# Altium schematic sheet РЕУН.468323.001_Power.SchDoc: =Name-1str
size 420 x 297 mm; SheetNumber: 2; Вид изделия: Документация; Раздел: Документация; Код документа: РЕУН.468323.001Э3; Вид документа: Схема электрическая принципиальная; Класс документа: Конструкторский документ; Создавать изделие в PLM: Yes; DocumentCode: РЕУН.468323.001 Э3 2D; DocumentView: Схема электрическая принципиальная; DocumentClass: Конструкторский документ; ProductView: Документация; Format: А3
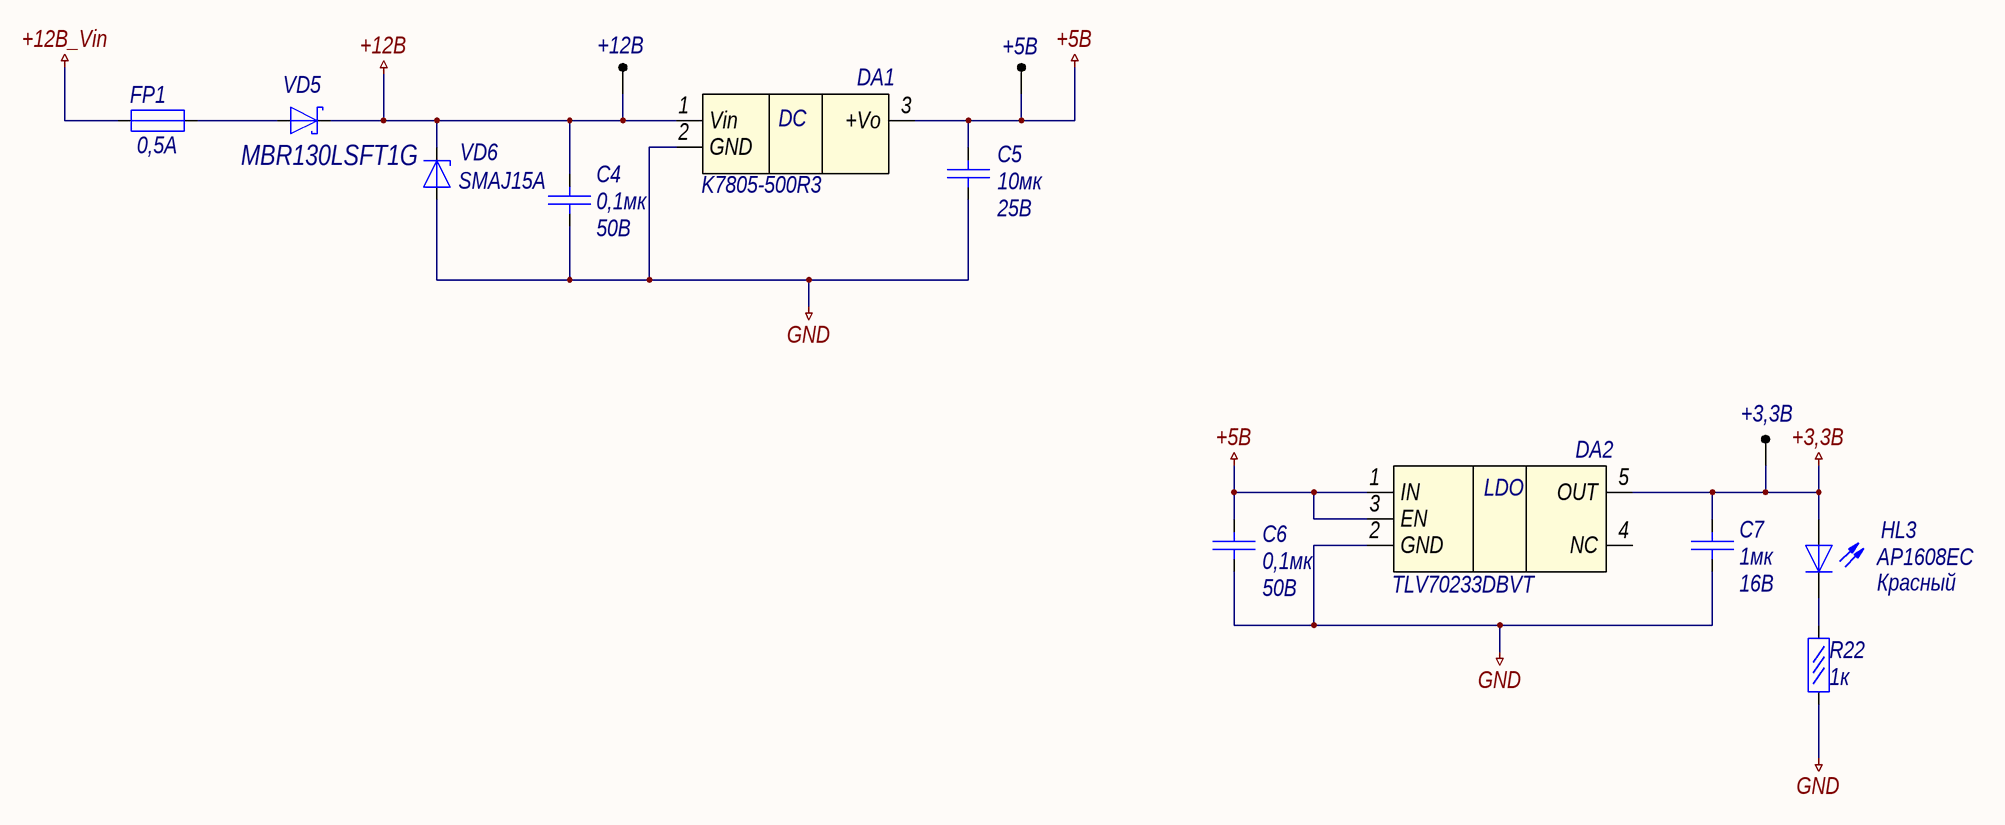
[diagram p0: РЕУН.468323.001_Power.SchDoc]

## Parts
+3,3В  "1"  [0.5 x 1_round]  (value not drawn)
+5В  "1"  [0.5 x 1_round]  (value not drawn)
+12В  "1"  [0.5 x 1_round]  (value not drawn)
C4  Voltage: 50В  [C0805_AA]  (hidden comment: 0,1мк)
C5  Voltage: 25В  [C0805_AA]  (hidden comment: 10мк)
C6  Voltage: 50В  [C0805_AA]  (hidden comment: 0,1мк)
C7  Voltage: 16В  [C0805_AA]  (hidden comment: 1мк)
DA1  K7805-500R3
DA2  TLV70233DBVT
FP1  value 0,5А  [R0805_H]
HL3  Vf: Красный  [D0603_A]  (hidden comment: AP1608EC)
R22  1к  [R1206]
VD5  MBR130LSFT1G  [SOD123_A]
VD6  SMAJ15A  [SOT23-2_A]

## Nets
+3,3В: +3,3В.1 C7.2 DA2.5(OUT) HL3.1(Анод)
+5В: +5В.1 C5.2 C6.2 DA1.3(+Vo) DA2.1(IN) DA2.3(EN)
+12В: +12В.1 C4.2 DA1.1(Vin) VD5.1(K) VD6.1(K)
+12В_Vin: FP1.1
GND: C4.1 C5.1 C6.1 C7.1 DA1.2(GND) DA2.2(GND) R22.1 VD6.2(A)
NetFP1_2: FP1.2 VD5.2(A)
NetHL3_2: HL3.2(Катод) R22.2

Not connected (* = marked no-connect by the designer): DA2 4(NC)

## Notes on the sheet
- Подп. и дата
- Инв. № дубл.
- Взам. инв. №
- Инв. № подл.
- Лист
- Изм.
- № докум.
- Подп.
- Дата
- Копировал
- Формат
- (in symbol K78xx-500R3) DC
- (in symbol TLV702) LDO

## Library data of the parts
+3,3В +5В +12В = TestPoint: Test point; Comment_1: "1"
C4-C7 = Конденсатор кер.
  C4 C6: Value: 0,1мк
  C5: Value: 10мк
  C7: Value: 1мк
DA1 = K78xx-500R3: DC/DC преобразователь неизолированный
DA2 = TLV702: LDO Regulator
FP1 = Fuse: Предохранитель
HL3 = LED_R: Светодиод; Name: AP1608EC
R22 = Резистор  0,05Вт: Резистор 0,05Вт; Power rating: 0,05Вт; Value: 1к
VD5 = DiodeSchottky: Диод Шоттки; Name: MBR130LSFT1G
VD6 = DiodeZener: Стабилитрон; Name: SMAJ15A